# Altium project Backscatter.PrjPcb
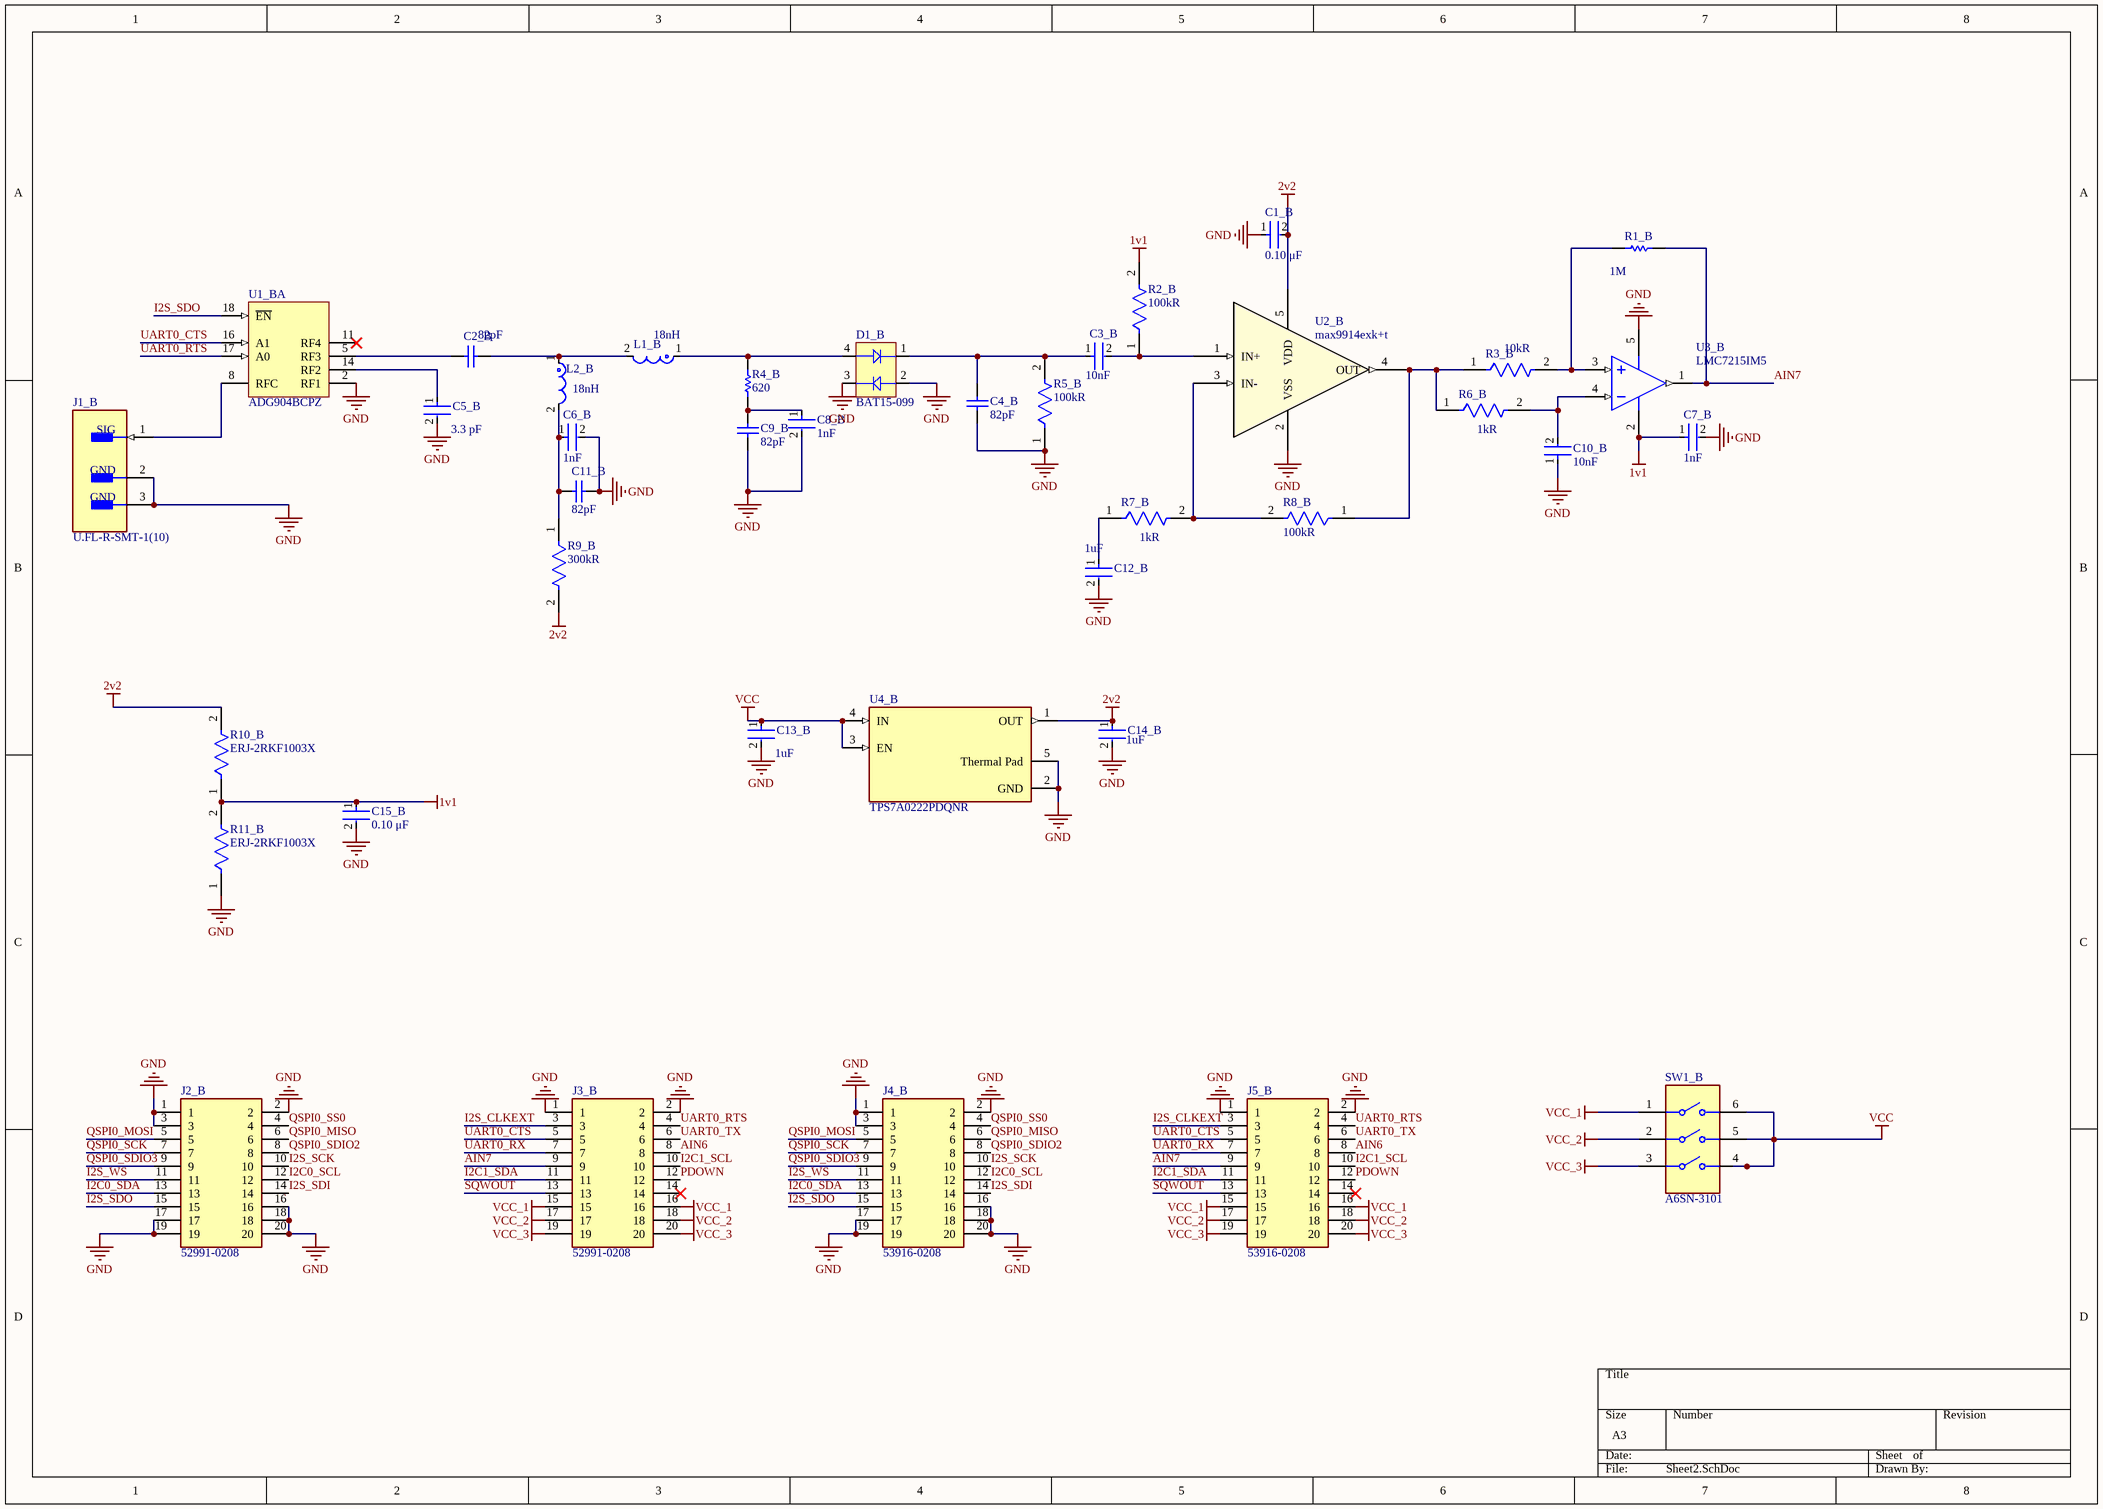
[diagram p0: Sheet2.SchDoc]
CAGE_CODE: ?????; CONTRACT_NUMBER: <CONTRACT NO>; DOC_NO_ASSY_DWG: <ASSY DWG NO>; DOC_NO_BOM: <BOM DOC NO>; DOC_NO_FAB_DWG: <FAB DWG NO>; DOC_NO_SCH_DWG: <SCH DWG NO>; PCB_2_DEC_TOL: +/-.01; PCB_3_DEC_TOL: +/-.010; PCB_ANG_TOL: +/-1/2; PCB_ASSEMBLY_NO: <PCB ASSY NO>; PCB_CHECKER: - -----; PCB_CHECKER_APP_DATE: --/--/----; PCB_DESIGNER: - -----; PCB_DESIGNER_APP_DATE: --/--/----; PCB_DWG_NO: <PCB DWG NO>; PCB_ENGINEER: - -----; PCB_ENGINEER_APP_DATE: --/--/----; PCB_PART_NUMBER: <PCB PN>; PCB_REV: A; SCH_REV: A
1 sheet, 39 parts. Net scope: global (net labels, ports and power ports of the same name join across sheets).
Board file: PCB3.PcbDoc

## Sheet Sheet2.SchDoc
size A3; SheetNumber: 1; SheetTotal: 1

### Parts
C1_B  Capacitance: 0.10 μF  [FP-C0402-BB-MFG]  (hidden comment: C0402C104K8PACTU)
C2_B  value 82pF  [CAPC1005X55X25ML05T10]  (hidden comment: GRM1555C1H820JA01D)
C3_B  Capacitance: 10nF  [FP-CL165-IPC_C]  (hidden comment: CL05B103KB5NNNC)
C4_B  value 82pF  [CAPC1005X55X25ML05T10]  (hidden comment: GRM1555C1H820JA01D)
C5_B  Capacitance: 3.3 pF  [FP-C0402-BB-MFG]  (hidden comment: C0402C339C5GACTU)
C6_B  Capacitance: 1nF  [FP-GRM155-0_05-IPC_B]  (hidden comment: GRM1555C1H102JA01D)
C7_B  Capacitance: 1nF  [FP-GRM155-0_05-IPC_B]  (hidden comment: GRM1555C1H102JA01D)
C8_B  Capacitance: 1nF  [FP-GRM155-0_05-IPC_B]  (hidden comment: GRM1555C1H102JA01D)
C9_B  value 82pF  [CAPC1005X55X25ML05T10]  (hidden comment: GRM1555C1H820JA01D)
C10_B  Capacitance: 10nF  [FP-CL165-IPC_C]  (hidden comment: CL05B103KB5NNNC)
C11_B  value 82pF  [CAPC1005X55X25ML05T10]  (hidden comment: GRM1555C1H820JA01D)
C12_B  Capacitance: 1uF  [FP-C0402C105K8PACTU-MFG]  (hidden comment: C0402C105K8PACTU)
C13_B  Capacitance: 1uF  [FP-C0402C105K8PACTU-MFG]  (hidden comment: C0402C105K8PACTU)
C14_B  Capacitance: 1uF  [FP-C0402C105K8PACTU-MFG]  (hidden comment: C0402C105K8PACTU)
C15_B  Capacitance: 0.10 μF  [FP-C0402-BB-MFG]  (hidden comment: C0402C104K8PACTU)
D1_B  BAT15-099  [INF-SOT143-4-1_V]
J1_B  U.FL-R-SMT-1(10)  [FP-U_FL-R-SMT-1_10-MFG]
J2_B  52991-0208  [MOLEX_52991-0208]
J3_B  52991-0208  [MOLEX_52991-0208]
J4_B  53916-0208  [MOLEX-  539160208]
J5_B  53916-0208  [MOLEX-  539160208]
L1_B  Inductance: 18nH  [FP-LQG15HH_02-IPC_A]  (hidden comment: LQG15HN18NJ02D)
L2_B  Inductance: 18nH  [FP-LQG15HH_02-IPC_A]  (hidden comment: LQG15HN18NJ02D)
R1_B  Resistance: 1M  [RESC1608X55X30LL15T15]  (hidden comment: ERJ-3EKF1004V)
R2_B  Resistance: 100kR  [FP-ERJ2RK-IPC_C]  (hidden comment: ERJ-2RKF1003X)
R3_B  Resistance: 10kR  [FP-CRCW0402-e3-IPC_B]  (hidden comment: CRCW040210K0FKED)
R4_B  620  [RESC1005X40X25NL05T05]
R5_B  Resistance: 100kR  [FP-ERJ2RK-IPC_C]  (hidden comment: ERJ-2RKF1003X)
R6_B  Resistance: 1kR  [FP-CRCW0402-e3-MFG]  (hidden comment: CRCW04021K00FKED)
R7_B  Resistance: 1kR  [FP-CRCW0402-e3-MFG]  (hidden comment: CRCW04021K00FKED)
R8_B  Resistance: 100kR  [FP-ERJ2RK-IPC_C]  (hidden comment: ERJ-2RKF1003X)
R9_B  Resistance: 300kR  [FP-CRCW0402-e3-IPC_C]  (hidden comment: CRCW0402300KFKED)
R10_B  ERJ-2RKF1003X  [FP-ERJ2RK-IPC_C]
R11_B  ERJ-2RKF1003X  [FP-ERJ2RK-IPC_C]
SW1_B  A6SN-3101  [FP-A6SN-3101-MFG]
U1_B  ADG904BCPZ  [ADI-CP-20-6_N]  (part A of 2)
U2_B  max9914exk+t  [21-0076E_MXM]
U3_B  LMC7215IM5  [DBV0005A_N]
U4_B  TPS7A0222PDQNR  [FP-DQN0004A-MFG]

### Nets
1v1: C7_B.1 C15_B.1 R2_B.2 R10_B.1 R11_B.2 U3_B.2(V+)
2v2: C1_B.2 C14_B.1 R9_B.2 R10_B.2 U2_B.5(VDD) U4_B.1(OUT)
GND: C1_B.1 C4_B.1 C5_B.2 C6_B.2 C7_B.2 C8_B.2 C9_B.1 C10_B.1 C11_B.2 C12_B.2 C13_B.2 C14_B.2 C15_B.2 D1_B.2(A2) D1_B.3(K2) J1_B.2(GND) J1_B.3(GND) J2_B.1 J2_B.2 J2_B.3 J2_B.16 J2_B.17 J2_B.18 J2_B.19 J2_B.20 J3_B.1 J3_B.2 J4_B.1 J4_B.2 J4_B.3 J4_B.16 J4_B.17 J4_B.18 J4_B.19 J4_B.20 J5_B.1 J5_B.2 R5_B.1 R11_B.1 U1_B.2(RF1) U2_B.2(VSS) U3_B.5(V-) U4_B.2(GND) U4_B.5(Thermal_Pad)
VCC: C13_B.1 SW1_B.4 SW1_B.5 SW1_B.6 U4_B.3(EN) U4_B.4(IN)
VCC_1: J3_B.15 J3_B.16 J5_B.15 J5_B.16 SW1_B.1
VCC_2: J3_B.17 J3_B.18 J5_B.17 J5_B.18 SW1_B.2
VCC_3: J3_B.19 J3_B.20 J5_B.19 J5_B.20 SW1_B.3
AIN6: J3_B.8 J5_B.8
AIN7: J3_B.9 J5_B.9 R1_B.2 U3_B.1(OUT)
I2C0_SCL: J2_B.12 J4_B.12
I2C0_SDA: J2_B.13 J4_B.13
I2C1_SCL: J3_B.10 J5_B.10
I2C1_SDA: J3_B.11 J5_B.11
I2S_CLKEXT: J3_B.3 J5_B.3
I2S_SCK: J2_B.10 J4_B.10
I2S_SDI: J2_B.14 J4_B.14
I2S_SDO: J2_B.15 J4_B.15 U1_B.18(~{EN})
I2S_WS: J2_B.11 J4_B.11
PDOWN: J3_B.12 J5_B.12
QSPI0_MISO: J2_B.6 J4_B.6
QSPI0_MOSI: J2_B.5 J4_B.5
QSPI0_SCK: J2_B.7 J4_B.7
QSPI0_SDIO2: J2_B.8 J4_B.8
QSPI0_SDIO3: J2_B.9 J4_B.9
QSPI0_SS0: J2_B.4 J4_B.4
SQWOUT: J3_B.13 J5_B.13
UART0_CTS: J3_B.5 J5_B.5 U1_B.16(A1)
UART0_RTS: J3_B.4 J5_B.4 U1_B.17(A0)
UART0_RX: J3_B.7 J5_B.7
UART0_TX: J3_B.6 J5_B.6
NetC2_B_1: C2_B.1 U1_B.5(RF3)
NetC2_B_2: C2_B.2 L1_B.2 L2_B.1
NetC3_B_1: C3_B.1 C4_B.2 D1_B.1(K1) R5_B.2
NetC3_B_2: C3_B.2 R2_B.1 U2_B.1(IN+)
NetC5_B_1: C5_B.1 U1_B.14(RF2)
NetC6_B_1: C6_B.1 C11_B.1 L2_B.2 R9_B.1
NetC8_B_1: C8_B.1 C9_B.2 R4_B.1
NetC10_B_2: C10_B.2 R6_B.2 U3_B.4(IN-)
NetC12_B_1: C12_B.1 R7_B.1
NetD1_B_4: D1_B.4(A1) L1_B.1 R4_B.2
NetJ1_B_1: J1_B.1(SIG) U1_B.8(RFC)
NetR1_B_1: R1_B.1 R3_B.2 U3_B.3(IN+)
NetR3_B_1: R3_B.1 R6_B.1 R8_B.1 U2_B.4(OUT)
NetR7_B_2: R7_B.2 R8_B.2 U2_B.3(IN-)

Not connected (* = marked no-connect by the designer): J3_B 14*; J5_B 14*; U1_B 11(RF4)*

### Library data of the parts
C1_B C15_B = CMP-2008-02046-2: CAP CER 0.1UF 10V X5R 0402; Manufacturer: Kemet; Material: Ceramic; Temperature Coefficient: 15%; Tolerance: 0.1; Value: 0.10 μF; Package: C0402-BB; Temperature: -55°C to +125°C; ComponentLink2Description: Datasheet; Temperature Characteristic: X5R; Device Class L1: Passive Components; Height: 0.55mm; Lead Free: Yes; ComponentLink2URL: https://content.kemet.com/datasheets/KEM_C1002_X7R_SMD.pdf; Device Class L2: Capacitors; Temperature Range Low: -55°C; Temperature Range High: +125°C; RoHS: TRUE; Octopart: https://octopart.com/c0402c104k8pactu-kemet-140039; Automotive: No; Mouser Description: Capacitor 100 nF 10 VDC 0402; Category: Cap; Voltage Rating: 10 V; Digikey Description: CAP CER 0.1UF 10V X5R 0402; Ipc Land Pattern Name: CAPC10050X50; Device Class L3: Ceramic Capacitors; Manufacturer Part Number: C0402C104K8PACTU
C2_B C4_B C9_B C11_B = CMP-2008-04442-1: Manufacturer: Murata; Part Number: GRM1555C1H820JA01D
C3_B C10_B = CMP-13271-000387-1: Cap Ceramic 10nF 50V X7R ±10% SMD 0402 +125°C Paper T/R; Depth: 0.5mm; Length: 1mm; Lead Free: Lead Free; Case Code (Metric): 1005; Width: 0.02inch; Min Operating Temperature: -55°C; Thickness: 0.022inch; Package Quantity: 1; Mount: Surface Mount; Height: 0.5mm; Voltage: 50V; Material: Ceramic; Tolerance: 10%; Case Code (Imperial): 0402; Radiation Hardening: No; Case/Package: 0402; Max Operating Temperature: 125°C; Voltage Rating (DC): 50V; Contact Plating: Tin; Packaging: Tape and Reel; Voltage Rating: 50V; Dielectric: X7R
C5_B = CMP-2008-03312-2: Capacitor: ceramic; MLCC; 3.3pF; 50VDC; C0G; ±0.25pF; SMD; 0402; Manufacturer: Kemet; Temperature Coefficient: 15%; Voltage Rating: 50 V; RoHS: TRUE; Material: Ceramic; Value: 3.3 pF; Height: 0.55mm; Manufacturer Part Number: C0402C339C5GACTU; Temperature: -55°C to +125°C; Package: C0402-BB; Mouser Description: Multilayer Ceramic Capacitors MLCC - SMD/SMT 50volts 3.3pF C0G .25pF; Category: Cap; ComponentLink2Description: Datasheet; Device Class L1: Passive Components; Tolerance: 0.25 pF; Temperature Characteristic: C0G; ComponentLink2URL: https://content.kemet.com/datasheets/KEM_C1002_X7R_SMD.pdf; Device Class L2: Capacitors; Temperature Range High: +125°C; Digikey Description: Capacitor: ceramic; MLCC; 3.3pF; 50VDC; C0G; ±0.25pF; SMD; 0402; Lead Free: Yes; Ipc Land Pattern Name: CAPC10050X50; Octopart: https://octopart.com/c0402c339c5gactu-kemet-105751; Automotive: No; Device Class L3: Ceramic Capacitors; Temperature Range Low: -55°C
C6_B C7_B C8_B = CMP-2008-04254-2: Chip Multilayer Ceramic Capacitors for General Purpose, 0402, 1000pF, C0G, 30ppm/°C, 5%, 50V; Insulation Resistance: 10GR; Packaging: Tape and Reel; Lead Free: Lead Free; Tolerance: 5%; Temperature Coefficient: 30ppm/°C; Thickness: 0.022inch; Termination: SMD/SMT; Max Operating Temperature: 125°C; Height: 0.5mm; Package Quantity: 1; Radiation Hardening: No; Material: Ceramic; Case Code (Metric): 1005; Number of Pins: 2; Voltage Rating: 50V; Mount: Surface Mount; Voltage: 50V; Case/Package: 0402; Min Operating Temperature: -55°C; Dielectric Material: Ceramic; Width: 0.5mm; Depth: 0.5mm; Case Code (Imperial): 0402; REACH SVHC: No SVHC; Dielectric: C0G; Voltage Rating (DC): 50V; Length: 1mm
C12_B C13_B C14_B = CMP-2008-02081-2: CAP CER 1UF 10V X5R 0402; Dielectric Material: Ceramic; Dissipation Factor: 5%; Tolerance: 10%; Number of Pins: 2; Contact Plating: Tin; Min Operating Temperature: -55°C; Termination: SMD/SMT; Lead Free: Lead Free; Construction: Flat; Voltage Rating (DC): 10V; Mount: Surface Mount; Series: C; Thickness: 0.022inch; Width: 0.5mm; Radiation Hardening: No; Dielectric: X5R; Height: 0.5mm; Voltage: 10V; Length: 1mm; Depth: 0.5mm; Max Operating Temperature: 85°C; Package Quantity: 1; Packaging: Tape and Reel; RoHS Compliant: Yes; Case Code (Imperial): 0402; Case Code (Metric): 1005; REACH SVHC: No SVHC; Voltage Rating: 10V; Case/Package: 0402
D1_B = CMP-1154-00009-1: Single Silicon Schottky Diode, 110 mA IF Max, SOT143-4-1, Green; Manufacturer: Infineon; CT (typ): 0.26 pF; Green: yes; Group: RF Mixer; IF (max): 110 mA; VF (typ): 0.23 V; VR (max): 4 V; ComponentLink3Description: Package Specification; PackageDescription: 4-Pin Small Outline Transistor Package, 1.3 x 2.9 mm Body; ComponentLink2URL: http://www.infineon.com/dgdl/bat15series.pdf?folderId=db3a304314dca3890114ff6812070b44&fileId=db3a304314dca3890114ff6b74ca0b48&location=en.Products.RF.RF_Mixer___Detector_Schottky_Diodes.DATASHEET.bat15series.pdf; ComponentLink1Description: Manufacturer URL; Mounting Technology: Surface Mount; ComponentLink1URL: http://www.infineon.com/; ComponentLink2Description: Datasheet; PartNumber: BAT15-099; ComponentLink3URL: http://www.infineon.com/dgdl/SOT143-Package_Overview.pdf?folderId=db3a30431936bc4b011952ce8b1b3bed&fileId=db3a30431936bc4b011952df42203c0c; PackageReference: SOT143-4-1; Configuration: Single; DatasheetVersion: Jun-2011
J1_B = CMP-2000-05152-3: CONN U.FL RCPT STR 50 OHM SMD; Max Frequency: 6GHz; Connector Type: Coaxial; Body Plating: Silver; Body Material: Bronze; Impedance: 50R; Dielectric Material: Polymer; Insulation Resistance: 500MR; Gender: Male; Packaging: Cut Tape; Length: 3mm; Package Quantity: 2500; Termination: Solder; Lead Free: Lead Free; Series: U.FL; Min Operating Temperature: -40°C; Fastening Type: Snap; Contact Material: Brass; Orientation: Straight; Wire/Cable Type: Coaxial; Frequency: 6GHz; Contact Plating: Gold; Depth: 3.1mm; Weight: 0.001764oz; Max Operating Temperature: 90°C; Radiation Hardening: No; REACH SVHC: No SVHC; Mount: Surface Mount; Housing Color: Beige
J2_B J3_B = 52991-0208: 20 Position Connector Receptacle, Center Strip Contacts Surface Mount Gold; MF: Molex; SnapEDA_Link: https://www.snapeda.com/parts/52991-0208/Molex/view-part/230631/?ref=snap; Availability: Unavailable; MP: 52991-0208; Price: None; Package: None; Value: *
L1_B L2_B = CMP-06042-010999-1: Multilayer type RF Inductor 18nH ±5% 0.51Ω 350mA 0402; Q Factor: 8; DC Resistance (DCR): 510mR; Core Material: Air; Self Resonant Frequency: 2.1GHz; Current Rating: 300mA; Shielding: Unshielded; Test Frequency: 100MHz; Width: 0.5mm; Min Operating Temperature: -55°C; Case/Package: 0402; Height: 0.5mm; REACH SVHC: No SVHC; Mount: Surface Mount; Radiation Hardening: No; Inductance Tolerance: 5%; Max Operating Temperature: 125°C; Height - Seated (Max): 0.022inch; DC Current: 300mA; Packaging: Tape and Reel; Depth: 0.55mm; Package Quantity: 1; Max DC Current: 300mA; Tolerance: 5%; Case Code (Metric): 1005; Length: 1mm; Lead Free: Lead Free; Case Code (Imperial): 0402; Military Standard: Not; Termination: SMD/SMT
R1_B = CMP-1012-00849-2: Manufacturer: Panasonic; Part Number: ERJ-3EKF1004V
R2_B R5_B R8_B = CMP-2002-00608-4: RES SMD 100K OHM 1% 1/10W 0402; Voltage Rating (DC): 50V; Power Rating: 100mW; Temperature Coefficient: 100ppm/°C; Case/Package: 0402; Length: 1mm; Package Quantity: 1; Radiation Hardening: No; Case Code (Metric): 1005; Contact Plating: Tin; Mount: Surface Mount; Depth: 0.5mm; Max Operating Temperature: 155°C; Lead Free: Lead Free; Width: 0.5mm; Composition: Thick Film; Case Code (Imperial): 0402; Tolerance: 1%; Termination: SMD/SMT; Number of Pins: 2; Height: 0.35mm; Voltage Rating: 50V; Military Standard: Not; REACH SVHC: No SVHC; Packaging: Tape and Reel; Min Operating Temperature: -55°C; Max Power Dissipation: 100mW; Features: Automotive AEC-Q200; Number of Terminations: 2
R3_B = CMP-2002-08135-2: RES SMD 10K OHM 1% 1/16W 0402; Power Rating: 63mW; Voltage Rating: 50V; Temperature Coefficient: 100ppm/°C; Case Code (Metric): 1005; Features: Automotive AEC-Q200; Termination: SMD/SMT; Mount: Surface Mount; Package Quantity: 10; Packaging: Tape and Reel; Case Code (Imperial): 0402; Weight: 2.3E-05oz; Lead Free: Lead Free; Width: 0.02inch; Max Power Dissipation: 63mW; Tolerance: 1%; Number of Terminations: 2; Height: 0.35mm; Number of Pins: 2; Composition: Thick Film; Length: 1mm; Voltage Rating (DC): 50V; Case/Package: 0402; Radiation Hardening: No; Contact Plating: Tin; Depth: 0.5mm; Military Standard: Not; Min Operating Temperature: -55°C; Max Operating Temperature: 155°C
R4_B = CMP-2002-01019-1: Part Number: ERJ-2RKF6200X; Manufacturer: Panasonic
R6_B R7_B = CMP-2002-08276-2: RES Thick Film, 1kΩ, 1%, 0.063W, 100ppm/°C, 0402; Power Rating: 63mW; Voltage Rating (DC): 50V; Package Quantity: 10; Termination: SMD/SMT; Width: 0.5mm; Military Standard: Not; Length: 1mm; Contact Plating: Tin; Mount: Surface Mount; Packaging: Tape and Reel; Case Code (Imperial): 0402; Tolerance: 1%; Weight: 2.3E-05oz; Number of Pins: 2; Case/Package: 0402; Case Code (Metric): 1005; Lead Free: Lead Free; Number of Terminations: 2; Max Power Dissipation: 63mW; Depth: 0.5mm; Temperature Coefficient: 100ppm/°C; Max Operating Temperature: 155°C; Height: 0.35mm; Features: Automotive AEC-Q200; Composition: Thick Film; Radiation Hardening: No; Voltage Rating: 50V; Min Operating Temperature: -55°C
R9_B = CMP-2002-08495-2: RES Thick Film, 300kΩ, 1%, 0.063W, 100ppm/°C, 0402; Power Rating: 63mW; Voltage Rating: 50V; Case/Package: 0402; Number of Pins: 2; Depth: 0.5mm; Temperature Coefficient: 100ppm/°C; Composition: Thick Film; Length: 1mm; Termination: SMD/SMT; Tolerance: 1%; Features: Automotive AEC-Q200; Max Power Dissipation: 63mW; Packaging: Tape and Reel; Military Standard: Not; Case Code (Metric): 1005; Voltage Rating (DC): 50V; Lead Free: Lead Free; Max Operating Temperature: 155°C; Min Operating Temperature: -55°C; Width: 0.02inch; Package Quantity: 10; Height: 0.35mm; Case Code (Imperial): 0402; Number of Terminations: 2; Mount: Surface Mount; Radiation Hardening: No; Contact Plating: Tin; Weight: 2.3E-05oz
R10_B R11_B = CMP-2002-00608-4: RES SMD 100K OHM 1% 1/10W 0402; Resistance: 100kR; Voltage Rating (DC): 50V; Power Rating: 100mW; Temperature Coefficient: 100ppm/°C; Case/Package: 0402; Length: 1mm; Package Quantity: 1; Radiation Hardening: No; Case Code (Metric): 1005; Contact Plating: Tin; Mount: Surface Mount; Depth: 0.5mm; Max Operating Temperature: 155°C; Lead Free: Lead Free; Width: 0.5mm; Composition: Thick Film; Case Code (Imperial): 0402; Tolerance: 1%; Termination: SMD/SMT; Number of Pins: 2; Height: 0.35mm; Voltage Rating: 50V; Military Standard: Not; REACH SVHC: No SVHC; Packaging: Tape and Reel; Min Operating Temperature: -55°C; Max Power Dissipation: 100mW; Features: Automotive AEC-Q200; Number of Terminations: 2
SW1_B = CMP-08827-000007-1: SWITCH SLIDE DIP SPST 25MA 24V; Manufacturer: Omron Electronics Inc-EMC Div; Electromechanical Life: 1000Cycles; Contact Resistance: 200mΩ; Standoff Height: 0.7mm; Description: DIP Switches / SIP Switches 3P Knife-Edge, 2.3mm Slide SMT Flat-Act; Number Of Circuits: 3; Device Class L2: Switches; Device Class L3: DIP Switches; Ambient Temperature Range High: +85°C; RoHS: TRUE; Temperature Range High: +85°C; Ambient Temperature Range Low: -30°C; ComponentLink2URL: https://omronfs.omron.com/en_US/ecb/products/pdf/en-a6sn.pdf; Category: Switch; Temperature Range Low: -30°C; Digikey Description: SWITCH SLIDE DIP SPST 25MA 24V; Package: A6SN-3101; Mouser Description: DIP Switches / SIP Switches 3P Knife-Edge, 2.3mm Slide SMT Flat-Act; Device Class L1: Electromechanical; Current Rating: 25mA; Lead Free: Yes; ComponentLink2Description: Datasheet; Throw Configuration: SPST; Voltage Rating Dc: 24V; Height: 4.55mm; Octopart: https://octopart.com/a6sn-3101-omron-55396000; Automotive: No; Manufacturer Part Number: A6SN-3101; Temperature: -30°C to +85°C
U1_B = CMP-0290-00002-2: Wideband 2.5 GHz, 37 dB Isolation at 1 GHz, CMOS 1.65 to 2.75 V, 4:1 Mux / SP4T, -40 to 85 degC, 20-pin QFN (CP-20-1), Tray; Manufacturer: Analog Devices; Supply V Guar Performance: Single_(+2.5V); Bandwidth (Hz): 2.5G; t transition (s): 12n; PackageVersion: 061708-A, 07/2011; ComponentLink2URL: http://www.analog.com/static/imported-files/data_sheets/ADG904_904R.pdf; ComponentLink1URL: http://www.analog.com/en/index.html; PackageDescription: 20-Pin Lead Frame Chip Scale Package, Body 4 x 4 mm, Pitch 0.5 mm; ComponentLink3URL: http://www.analog.com/static/imported-files/packages/PKG_PDF/LFCSP(CP)/CP_20_6.pdf; PartNumber: ADG904BCPZ; PackageReference: CP-20-6; ComponentLink3Description: Package Specification; ComponentLink2Description: Datasheet; Code_JEDEC: MO-220; Mounting Technology: Surface Mount; DatasheetVersion: Rev. B; Packing: Tray; ComponentLink1Description: Manufacturer URL
U2_B = max9914exk+t: No Description Available; SourceLibrary: Maxim_2009-12-17_3b; Built_By: EMA_UL_Team; Vendor: Maxim Integrated Products; Manufacturer_Part_Number: max9914exk+t; Copyright: Copyright (C) 2021 Accelerated Designs. All rights reserved; RefDes: RefDes; Type: DEV
U3_B = CMP-0055-01229-3: Micro-Power, Rail-to-Rail CMOS Comparators with Open-Drain/Push-Pull Outputs, 5-pin SOT-23; Manufacturer: Texas Instruments; PackageTopMarking: C02B*XTT; PowerWise: Y; CompType: Amplifiers; ComponentLink1URL: http://www.ti.com/general/docs/lit/getliterature.tsp?genericPartNumber=LMC7215&fileType=pdf; PackageDescription: Molded SOT-23, .115 x .063 x .040 in Body, 5 Lead, .0375 in Pitch; RoHS: N; PinCount: 5; Package Reference: DBV0005A; ComponentLink1Description: Datasheet URL
U4_B = CMP-04917-000120-1: IC REG LINEAR 1.8V 200MA 4X2SON